# Altium project My_Robot.PrjPcb
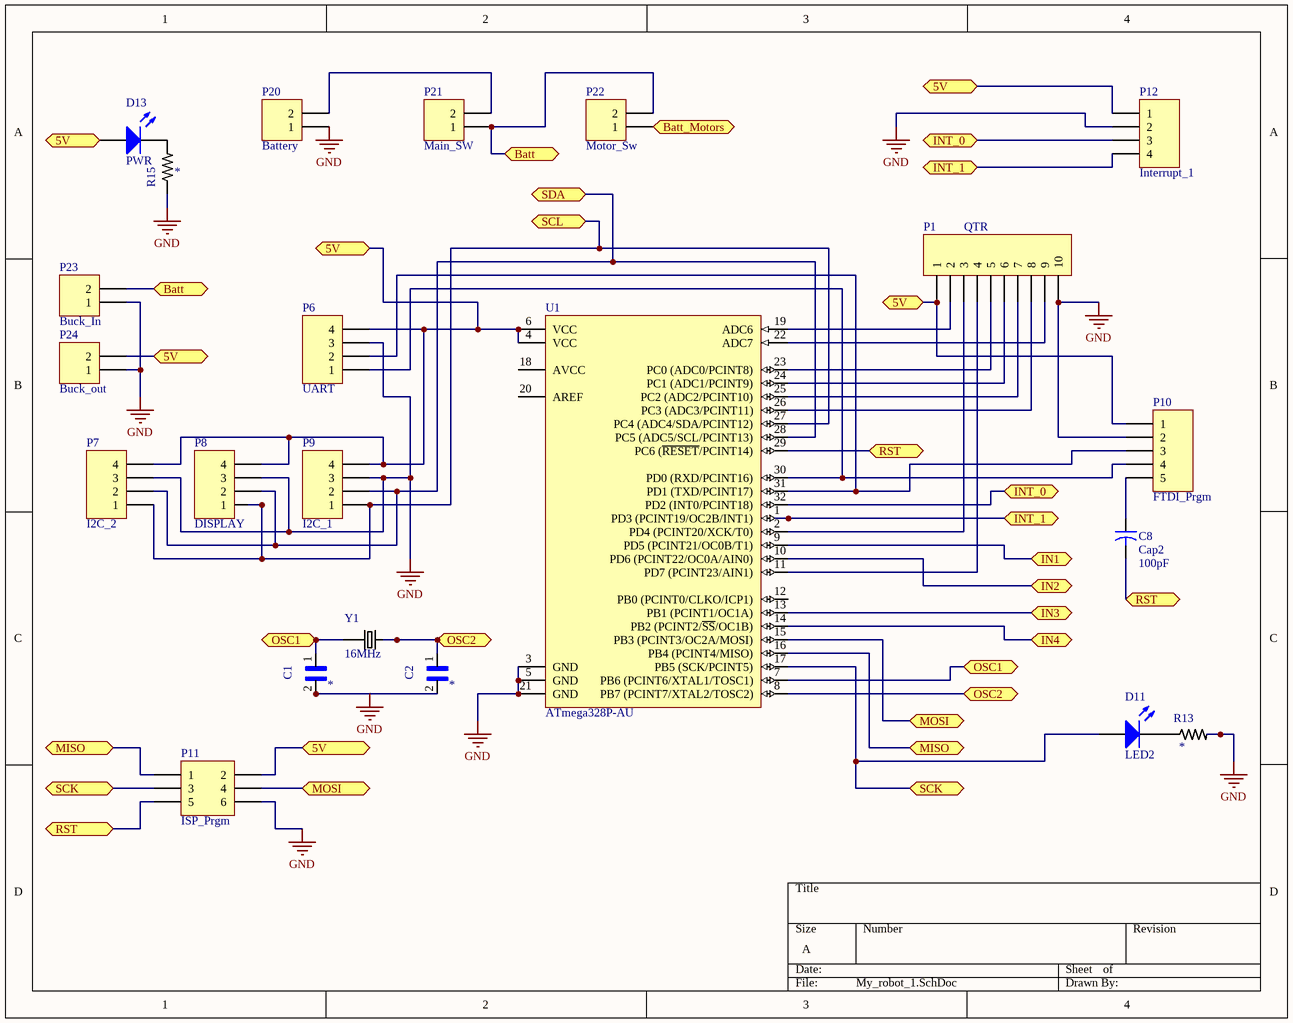
[diagram p0: My_robot_1.SchDoc]
3 sheets, 77 parts. Net scope: flat (ports and power ports of the same name join across sheets).
Board file: my_ROBOT.PcbDoc
Sheets:
  My_robot_1.SchDoc
  Motor_control.SchDoc
  MCU_2.SchDoc

## Sheet My_robot_1.SchDoc
size A

### Parts
C1  Cap_0805  [CAP_0805]  (value not drawn)
C2  Cap_0805  [CAP_0805]  (value not drawn)
C8  Cap2  value 100pF  [CAPR5-4X5]
D11  LED2  [3.2X1.6X1.1]
D13  PWR  [3.2X1.6X1.1]
P1  QTR  [HDR1X10]
P6  UART  [HDR1X4]
P7  I2C_2  [HDR1X4]
P8  DISPLAY  [HDR1X4]
P9  I2C_1  [HDR1X4]
P10  FTDI_Prgm  [HDR1X5]
P11  ISP_Prgm  [HDR2X3]
P12  Interrupt_1  [HDR1X4]
P20  Battery  [HDR1X2]
P21  Main_SW  [HDR1X2]
P22  Motor_Sw  [HDR1X2]
P23  Buck_In  [HDR1X2]
P24  Buck_out  [HDR1X2]
R13  Res_0805  [Res_0805]  (value not drawn)
R15  Res_0805  [Res_0805]  (value not drawn)
U1  ATmega328P-AU  [32A_N]
Y1  16MHz  [XTAL_THT]

### Ports
5V, Batt, Batt_Motors, IN1, IN2, IN3, IN4, INT_0, INT_1, MISO, MOSI, OSC1, OSC2, RST, SCK, SCL, SDA

### Nets
GND: C1.2 C2.2 P1.10 P6.3 P7.3 P8.3 P9.3 P10.2 P11.6 P12.2 P20.1 P23.1 P24.1 R13.2 R15.1 U1.3(GND) U1.5(GND) U1.21(GND)
NetC1_1: C1.1 U1.7(PB6_(PCINT6/XTAL1/TOSC1)) Y1.1 ; port OSC1
NetC2_1: C2.1 U1.8(PB7_(PCINT7/XTAL2/TOSC2)) Y1.2 ; port OSC2
NetC8_1: C8.1 P10.5
NetC8_2: C8.2 P11.5 U1.29(PC6_(~{RESET}/PCINT14)) ; port RST
NetD11_1: D11.1(A) P11.3 U1.17(PB5_(SCK/PCINT5)) ; port SCK
NetD11_2: D11.2(K) R13.1
NetD13_1: D13.1(A) P1.1 P6.4 P7.4 P8.4 P9.4 P10.1 P11.2 P12.1 P24.2 U1.4(VCC) U1.6(VCC) ; port 5V
NetD13_2: D13.2(K) R15.2
NetD14_1: P22.1 ; port Batt_Motors
NetP1_2: P1.2 U1.19(ADC6)
NetP1_3: P1.3 U1.2(PD4_(PCINT20/XCK/T0))
NetP1_4: P1.4 U1.11(PD7_(PCINT23/AIN1))
NetP1_5: P1.5 U1.23(PC0_(ADC0/PCINT8))
NetP1_6: P1.6 U1.24(PC1_(ADC1/PCINT9))
NetP1_7: P1.7 U1.25(PC2_(ADC2/PCINT10))
NetP1_8: P1.8 U1.26(PC3_(ADC3/PCINT11))
NetP1_9: P1.9 U1.22(ADC7)
NetP6_1: P6.1 P10.4 U1.30(PD0_(RXD/PCINT16))
NetP6_2: P6.2 P10.3 U1.31(PD1_(TXD/PCINT17))
NetP7_1: P7.1 P8.1 P9.1 U1.27(PC4_(ADC4/SDA/PCINT12)) ; port SCL
NetP7_2: P7.2 P8.2 P9.2 U1.28(PC5_(ADC5/SCL/PCINT13)) ; port SDA
NetP11_1: P11.1 U1.16(PB4_(PCINT4/MISO)) ; port MISO
NetP11_4: P11.4 U1.15(PB3_(PCINT3/OC2A/MOSI)) ; port MOSI
NetP12_3: P12.3 U1.32(PD2_(INT0/PCINT18)) ; port INT_0
NetP12_4: P12.4 U1.1(PD3_(PCINT19/OC2B/INT1)) ; port INT_1
NetP20_2: P20.2 P21.2
NetP21_1: P21.1 P22.2 P23.2 ; port Batt
NetU1_9: U1.9(PD5_(PCINT21/OC0B/T1)) ; port IN1
NetU1_10: U1.10(PD6_(PCINT22/OC0A/AIN0)) ; port IN2
NetU1_13: U1.13(PB1_(PCINT1/OC1A)) ; port IN3
NetU1_14: U1.14(PB2_(PCINT2/~{SS}/OC1B)) ; port IN4

Not connected (* = marked no-connect by the designer): U1 12(PB0_(PCINT0/CLKO/ICP1)) 18(AVCC) 20(AREF)

### Library data of the parts
C1 C2 = Cap_0805: Cap Ceramic 10uF 10V X5R 10% SMD 0805 85Â°C Embossed Plastic T/R; MF: Samsung Electro-Mechanics; MP: CL21A106KPFNNWE; Price: None; SnapEDA_Link: https://www.snapeda.com/parts/CL21A106KPFNNWE/Samsung%20Electro-Mechanics/view-part/?ref=snap; Package: 0805 Samsung; Availability: Unavailable; Value: *
C8 = Cap2: Capacitor; Published: 23-Sep-2002; PackageReference: CAPR5-4X5; Publisher: Altium Limited; PackageDescription: Capacitor; 2 Leads
D11 D13 = LED2: Typical RED, GREEN, YELLOW, AMBER GaAs LED; Published: 8-Jun-2000; LatestRevisionDate: 17-Jul-2002; LatestRevisionNote: Re-released for DXP Platform.; PackageVersion: Feb-2002; PackageReference: 3.2X1.6X1.1; Publisher: Altium Limited; PackageDescription: SM LED; 2 Flat Leads
P1 = Header 10: Header, 10-Pin; LatestRevisionDate: 17-Jul-2002; LatestRevisionNote: Re-released for DXP Platform.; Publisher: Altium Limited
P6-P9 P12 = Header 4: Header, 4-Pin; LatestRevisionDate: 17-Jul-2002; LatestRevisionNote: Re-released for DXP Platform.; Publisher: Altium Limited
P10 = Header 5: Header, 5-Pin; LatestRevisionDate: 17-Jul-2002; LatestRevisionNote: Re-released for DXP Platform.; Publisher: Altium Limited
P11 = Header 3X2: Header, 3-Pin, Dual row; LatestRevisionDate: 17-Jul-2002; LatestRevisionNote: Re-released for DXP Platform.; Publisher: Altium Limited
P20-P24 = Header 2: Header, 2-Pin; LatestRevisionDate: 17-Jul-2002; LatestRevisionNote: Re-released for DXP Platform.; Publisher: Altium Limited
R13 R15 = Res_0805: Res Thick Film 0805 392 Ohm 1% 1/3W Â±100ppm/Â°C Molded SMD SMD T/R; MP: CRGH0805F392R; MF: TE Connectivity; TE_purchase_URL: https://www.te.com/usa-en/product-5-1879509-5.html?te_bu=Cor&te_type=disp&te_campaign=seda_glo_cor-seda-global-disp-prtnr-fy19-seda-model-bom-cta_sma-317_1&elqCampaignId=32493; Availability: Unavailable; SnapEDA_Link: https://www.snapeda.com/parts/CRGH0805F392R/TE%20Connectivity%20Passive%20Product/view-part/?ref=snap; Price: None; Package: 0805 TE Connectivity; Value: *
U1 = ATmega328P-AU: 8-bit AVR Microcontroller, 32KB Flash, 1KB EEPROM, 2KB SRAM, 32-pin TQFP, Industrial Grade (-40°C to 85°C); Published: 1-Apr-2010; DatasheetVersion: revA, Jan-2010; PackageVersion: revB, Oct-2001; PackageReference: 32A; Publisher: Altium Limited; PackageDescription: 32-Lead, 7x7x1.0 mm Body, 0.8mm Lead Pitch, Thin Profile Plastic Quad Flat Package (TQFP); Supplier 1: Digi-Key; Supplier Part Number 1: ATMEGA328P-AU-ND; Supplier 2: Farnell; Supplier Part Number 2: 1715486; Supplier 3: Mouser; Supplier Part Number 3: 556-ATMEGA328P-AU; Code_JEDEC: MS-026-ABA; ComponentLink1Description: Manufacturer Link; ComponentLink1URL: http://www.atmel.com/products/avr/default.asp?; ComponentLink2Description: ATmega48A/48PA/88A/88PA/168A/168PA/328/328P Datasheet; ComponentLink2URL: http://www.atmel.com/dyn/resources/prod_documents/8271.pdf; ComponentLink3Description: ATmega48A/48PA/88A/88PA/168A/168PA/328/328P Summary; ComponentLink3URL: http://www.atmel.com/dyn/resources/prod_documents/8271S.pdf; ComponentLink4Description: Atmel.com Home; ComponentLink4URL: http://www.atmel.com
Y1 = Xtal_THT: Crystal 3.93216MHz 17pF 2-Pin HC-49/U; MF: ECS Inc.; MP: ECS-39-17-1X; Availability: Unavailable; Price: None; SnapEDA_Link: https://www.snapeda.com/parts/ECS-39-17-1X/ECS%20Inc./view-part/?ref=snap; Package: HC49/U ECS International; Value: *

## Sheet Motor_control.SchDoc
size A
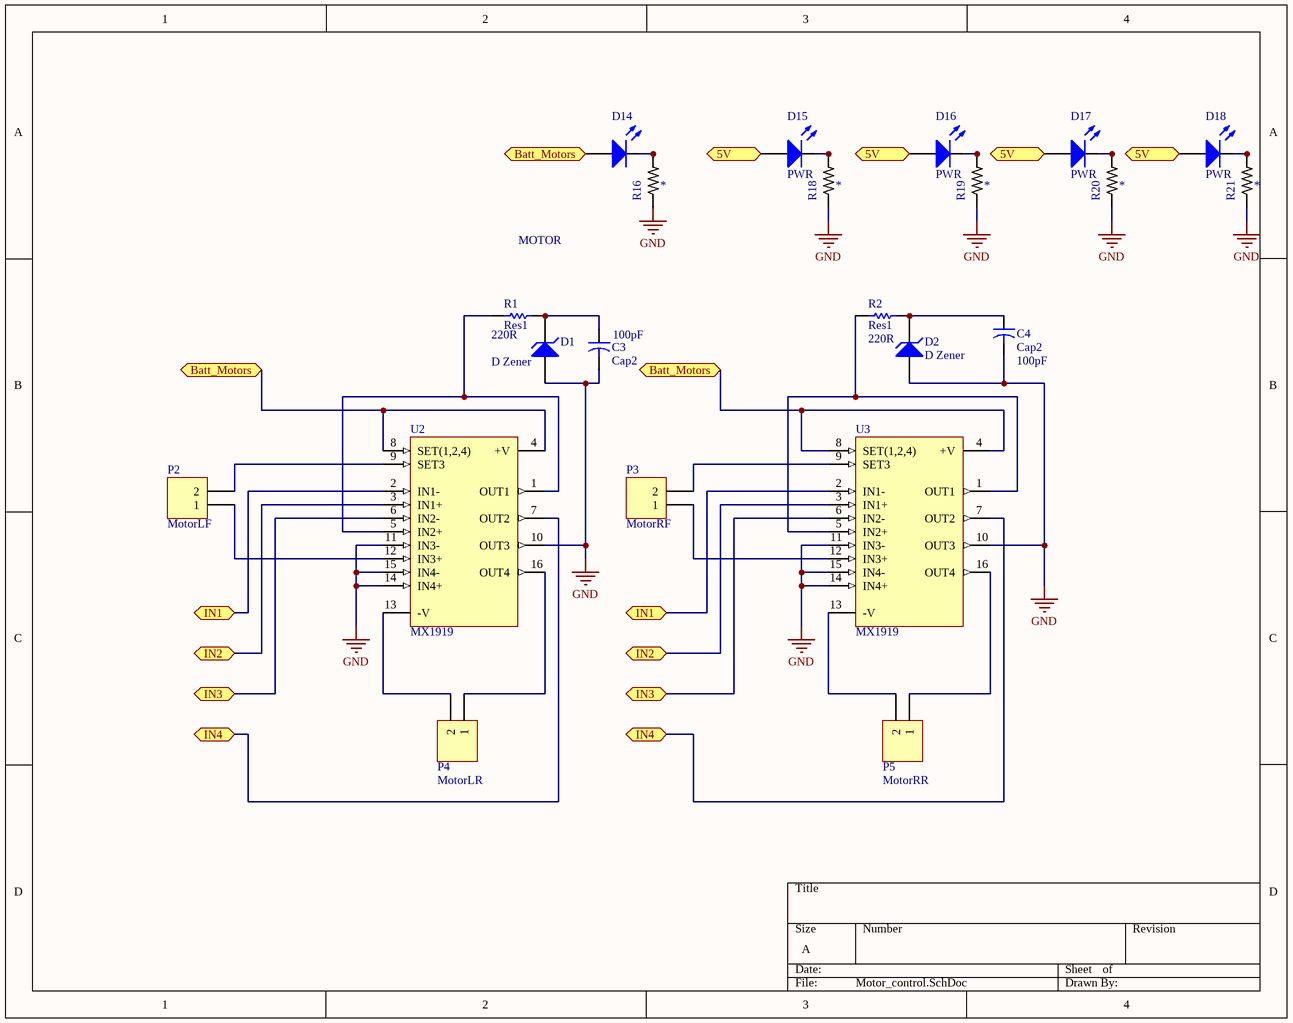
[diagram p1: Motor_control.SchDoc]

### Parts
C3  Cap2  value 100pF  [CAPR5-4X5]
C4  Cap2  value 100pF  [CAPR5-4X5]
D1  D Zener  [DIODE-0.7]
D2  D Zener  [DIODE-0.7]
D14  MOTOR  [3.2X1.6X1.1]
D15  PWR  [3.2X1.6X1.1]
D16  PWR  [3.2X1.6X1.1]
D17  PWR  [3.2X1.6X1.1]
D18  PWR  [3.2X1.6X1.1]
P2  MotorLF  [Micro_Metal_Motor]
P3  MotorRF  [Micro_Metal_Motor]
P4  MotorLR  [Micro_Metal_Motor]
P5  MotorRR  [Micro_Metal_Motor]
R1  Res1  value 220R  [AXIAL-0.3]
R2  Res1  value 220R  [AXIAL-0.3]
R16  Res_0805  [Res_0805]  (value not drawn)
R18  Res_0805  [Res_0805]  (value not drawn)
R19  Res_0805  [Res_0805]  (value not drawn)
R20  Res_0805  [Res_0805]  (value not drawn)
R21  Res_0805  [Res_0805]  (value not drawn)
U2  MX1919  [DIP16]
U3  MX1919  [DIP16]

### Ports
5V, Batt_Motors, IN1, IN2, IN3, IN4

### Nets
GND: C3.2 C4.2 D1.1(A) D2.1(A) R16.1 R18.1 R19.1 R20.1 R21.1 U2.10(OUT3) U2.11(IN3-) U2.14(IN4+) U2.15(IN4-) U3.10(OUT3) U3.11(IN3-) U3.14(IN4+) U3.15(IN4-)
NetC3_1: C3.1 D1.2(K) R1.1
NetC4_1: C4.1 D2.2(K) R2.1
NetD13_1: D15.1(A) D16.1(A) D17.1(A) D18.1(A) ; port 5V
NetD14_1: D14.1(A) U2.4(+V) U2.8(SET(1,2,4)) U3.4(+V) U3.8(SET(1,2,4)) ; port Batt_Motors
NetD14_2: D14.2(K) R16.2
NetD15_2: D15.2(K) R18.2
NetD16_2: D16.2(K) R19.2
NetD17_2: D17.2(K) R20.2
NetD18_2: D18.2(K) R21.2
NetP2_1: P2.1 U2.12(IN3+)
NetP2_2: P2.2 U2.9(SET3)
NetP3_1: P3.1 U3.12(IN3+)
NetP3_2: P3.2 U3.9(SET3)
NetP4_1: P4.1 U2.16(OUT4)
NetP4_2: P4.2 U2.13(-V)
NetP5_1: P5.1 U3.16(OUT4)
NetP5_2: P5.2 U3.13(-V)
NetR1_2: R1.2 U2.1(OUT1) U2.5(IN2+)
NetR2_2: R2.2 U3.1(OUT1) U3.5(IN2+)
NetU1_9: U2.2(IN1-) U3.2(IN1-) ; port IN1
NetU1_10: U2.3(IN1+) U3.3(IN1+) ; port IN2
NetU1_13: U2.6(IN2-) U3.6(IN2-) ; port IN3
NetU1_14: U2.7(OUT2) U3.7(OUT2) ; port IN4

### Library data of the parts
C3 C4 = Cap2: Capacitor; Published: 23-Sep-2002; PackageReference: CAPR5-4X5; Publisher: Altium Limited; PackageDescription: Capacitor; 2 Leads
D1 D2 = D Zener: Zener Diode; Published: 8-Jun-2000; LatestRevisionDate: 17-Jul-2002; LatestRevisionNote: Re-released for DXP Platform.; PackageReference: DIODE-0.7; Publisher: Altium Limited; PackageDescription: Diode, Thru-Hole; 2 Leads; 0.7 in Pin Spacing
D14-D18 = LED2: as D11 on sheet My_robot_1; Published: 8-Jun-2000; LatestRevisionDate: 17-Jul-2002; LatestRevisionNote: Re-released for DXP Platform.; PackageVersion: Feb-2002; PackageReference: 3.2X1.6X1.1; Publisher: Altium Limited; PackageDescription: SM LED; 2 Flat Leads
P2-P5 = Header 2: Header, 2-Pin; LatestRevisionDate: 17-Jul-2002; LatestRevisionNote: Re-released for DXP Platform.; Publisher: Altium Limited
R1 R2 = Res1: Resistor; Published: 8-Jun-2000; LatestRevisionDate: 17-Jul-2002; LatestRevisionNote: Re-released for DXP Platform.; PackageReference: AXIAL-0.3; Publisher: Altium Limited; PackageDescription: Axial Device, Thru-Hole; 2 Leads; 0.3 in Pin Spacing
R16 R18-R21 = Res_0805: as R13 on sheet My_robot_1; TE_purchase_URL: https://www.te.com/usa-en/product-5-1879509-5.html?te_bu=Cor&te_type=disp&te_campaign=seda_glo_cor-seda-global-disp-prtnr-fy19-seda-model-bom-cta_sma-317_1&elqCampaignId=32493; Availability: Unavailable; SnapEDA_Link: https://www.snapeda.com/parts/CRGH0805F392R/TE%20Connectivity%20Passive%20Product/view-part/?ref=snap; Price: None; Package: 0805 TE Connectivity; Value: *
U2 U3 = LM246N: Programmable Quad Bipolar Operational Amplifier; Published: 24-Aug-2001; LatestRevisionDate: 06-Jun-2005; LatestRevisionNote: Stylized 3D Model Added.; DatasheetVersion: Nov-1997; PackageVersion: Apr-1996; PackageReference: DIP16; Publisher: Altium Limited; PackageDescription: DIP; 16 Leads; Row Spacing 7.62 mm; Pitch 2.54 mm; ComponentLink1Description: Manufacturer Link; ComponentLink1URL: http://www.st.com/; ComponentLink2Description: Datasheet; ComponentLink2URL: http://www.st.com/stonline/products/literature/ds/2160/lm346.pdf

## Sheet MCU_2.SchDoc
size A
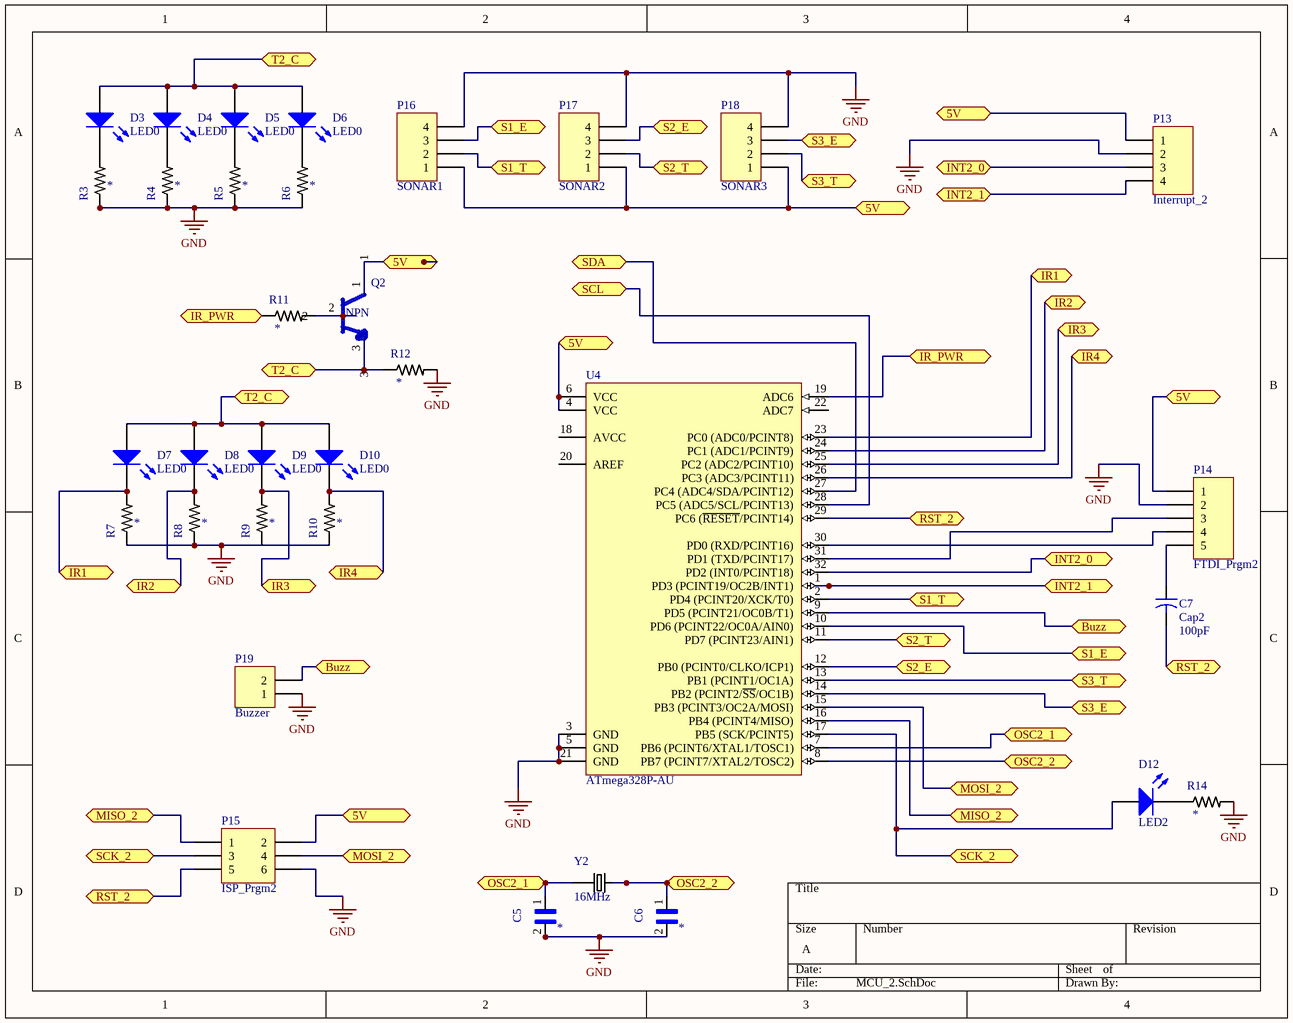
[diagram p2: MCU_2.SchDoc]

### Parts
C5  Cap_0805  [CAP_0805]  (value not drawn)
C6  Cap_0805  [CAP_0805]  (value not drawn)
C7  Cap2  value 100pF  [CAPR5-4X5]
D3  LED0  [LED-1]
D4  LED0  [LED-1]
D5  LED0  [LED-1]
D6  LED0  [LED-1]
D7  LED0  [LED-1]
D8  LED0  [LED-1]
D9  LED0  [LED-1]
D10  LED0  [LED-1]
D12  LED2  [3.2X1.6X1.1]
P13  Interrupt_2  [HDR1X4]
P14  FTDI_Prgm2  [HDR1X5]
P15  ISP_Prgm2  [HDR2X3]
P16  SONAR1  [HDR1X4]
P17  SONAR2  [HDR1X4]
P18  SONAR3  [HDR1X4]
P19  Buzzer  [HDR1X2]
Q2  NPN  [NPN-d400]
R3  Res_0805  [Res_0805]  (value not drawn)
R4  Res_0805  [Res_0805]  (value not drawn)
R5  Res_0805  [Res_0805]  (value not drawn)
R6  Res_0805  [Res_0805]  (value not drawn)
R7  Res_0805  [Res_0805]  (value not drawn)
R8  Res_0805  [Res_0805]  (value not drawn)
R9  Res_0805  [Res_0805]  (value not drawn)
R10  Res_0805  [Res_0805]  (value not drawn)
R11  Res_0805  [Res_0805]  (value not drawn)
R12  Res_0805  [Res_0805]  (value not drawn)
R14  Res_0805  [Res_0805]  (value not drawn)
U4  ATmega328P-AU  [32A_N]
Y2  16MHz  [XTAL_THT]

### Ports
5V, Buzz, INT2_0, INT2_1, IR1, IR2, IR3, IR4, IR_PWR, MISO_2, MOSI_2, OSC2_1, OSC2_2, RST_2, S1_E, S1_T, S2_E, S2_T, S3_E, S3_T, SCK_2, SCL, SDA, T2_C

### Nets
GND: C5.2 C6.2 P13.2 P14.2 P15.6 P16.4 P17.4 P18.4 P19.1 R3.1 R4.1 R5.1 R6.1 R7.1 R8.1 R9.1 R10.1 R12.2 R14.2 U4.3(GND) U4.5(GND) U4.21(GND)
NetC5_1: C5.1 U4.7(PB6_(PCINT6/XTAL1/TOSC1)) Y2.1 ; port OSC2_1
NetC6_1: C6.1 U4.8(PB7_(PCINT7/XTAL2/TOSC2)) Y2.2 ; port OSC2_2
NetC7_1: C7.1 P14.5
NetC7_2: C7.2 P15.5 U4.29(PC6_(~{RESET}/PCINT14)) ; port RST_2
NetD3_1: D3.1(A) D4.1(A) D5.1(A) D6.1(A) D7.1(A) D8.1(A) D9.1(A) D10.1(A) Q2.3 R12.1 ; port T2_C
NetD3_2: D3.2(K) R3.2
NetD4_2: D4.2(K) R4.2
NetD5_2: D5.2(K) R5.2
NetD6_2: D6.2(K) R6.2
NetD7_2: D7.2(K) R7.2 U4.23(PC0_(ADC0/PCINT8)) ; port IR1
NetD8_2: D8.2(K) R8.2 U4.24(PC1_(ADC1/PCINT9)) ; port IR2
NetD9_2: D9.2(K) R9.2 U4.25(PC2_(ADC2/PCINT10)) ; port IR3
NetD10_2: D10.2(K) R10.2 U4.26(PC3_(ADC3/PCINT11)) ; port IR4
NetD12_1: D12.1(A) P15.3 U4.17(PB5_(SCK/PCINT5)) ; port SCK_2
NetD12_2: D12.2(K) R14.1
NetD13_1: P13.1 P14.1 P15.2 P16.1 P17.1 P18.1 Q2.1 U4.4(VCC) U4.6(VCC) ; port 5V
NetP7_1: U4.28(PC5_(ADC5/SCL/PCINT13)) ; port SCL
NetP7_2: U4.27(PC4_(ADC4/SDA/PCINT12)) ; port SDA
NetP13_3: P13.3 U4.32(PD2_(INT0/PCINT18)) ; port INT2_0
NetP13_4: P13.4 U4.1(PD3_(PCINT19/OC2B/INT1)) ; port INT2_1
NetP14_3: P14.3 U4.31(PD1_(TXD/PCINT17))
NetP14_4: P14.4 U4.30(PD0_(RXD/PCINT16))
NetP15_1: P15.1 U4.16(PB4_(PCINT4/MISO)) ; port MISO_2
NetP15_4: P15.4 U4.15(PB3_(PCINT3/OC2A/MOSI)) ; port MOSI_2
NetP16_2: P16.2 U4.2(PD4_(PCINT20/XCK/T0)) ; port S1_T
NetP16_3: P16.3 U4.10(PD6_(PCINT22/OC0A/AIN0)) ; port S1_E
NetP17_2: P17.2 U4.11(PD7_(PCINT23/AIN1)) ; port S2_T
NetP17_3: P17.3 U4.12(PB0_(PCINT0/CLKO/ICP1)) ; port S2_E
NetP18_2: P18.2 U4.13(PB1_(PCINT1/OC1A)) ; port S3_T
NetP18_3: P18.3 U4.14(PB2_(PCINT2/~{SS}/OC1B)) ; port S3_E
NetP19_2: P19.2 U4.9(PD5_(PCINT21/OC0B/T1)) ; port Buzz
NetQ2_2: Q2.2 R11.2
NetR11_1: R11.1 U4.19(ADC6) ; port IR_PWR

Not connected (* = marked no-connect by the designer): U4 18(AVCC) 20(AREF) 22(ADC7)

### Library data of the parts
C5 C6 = Cap_0805: as C1 on sheet My_robot_1; Price: None; SnapEDA_Link: https://www.snapeda.com/parts/CL21A106KPFNNWE/Samsung%20Electro-Mechanics/view-part/?ref=snap; Package: 0805 Samsung; Availability: Unavailable; Value: *
C7 = Cap2: Capacitor; Published: 23-Sep-2002; PackageReference: CAPR5-4X5; Publisher: Altium Limited; PackageDescription: Capacitor; 2 Leads
D3-D10 = LED0: Typical INFRARED GaAs LED; Published: 8-Jun-2000; LatestRevisionDate: 08-Jul-2005; LatestRevisionNote: Mech Layer 1 removed.; PackageReference: LED-0; Publisher: Altium Limited; PackageDescription: LED; 2 Leads
D12 = LED2: as D11 on sheet My_robot_1; Published: 8-Jun-2000; LatestRevisionDate: 17-Jul-2002; LatestRevisionNote: Re-released for DXP Platform.; PackageVersion: Feb-2002; PackageReference: 3.2X1.6X1.1; Publisher: Altium Limited; PackageDescription: SM LED; 2 Flat Leads
P13 P16-P18 = Header 4: Header, 4-Pin; LatestRevisionDate: 17-Jul-2002; LatestRevisionNote: Re-released for DXP Platform.; Publisher: Altium Limited
P14 = Header 5: Header, 5-Pin; LatestRevisionDate: 17-Jul-2002; LatestRevisionNote: Re-released for DXP Platform.; Publisher: Altium Limited
P15 = Header 3X2: Header, 3-Pin, Dual row; LatestRevisionDate: 17-Jul-2002; LatestRevisionNote: Re-released for DXP Platform.; Publisher: Altium Limited
P19 = Header 2: Header, 2-Pin; LatestRevisionDate: 17-Jul-2002; LatestRevisionNote: Re-released for DXP Platform.; Publisher: Altium Limited
Q2 = Component_1: NPN- d400
R3-R12 R14 = Res_0805: as R13 on sheet My_robot_1; TE_purchase_URL: https://www.te.com/usa-en/product-5-1879509-5.html?te_bu=Cor&te_type=disp&te_campaign=seda_glo_cor-seda-global-disp-prtnr-fy19-seda-model-bom-cta_sma-317_1&elqCampaignId=32493; Availability: Unavailable; SnapEDA_Link: https://www.snapeda.com/parts/CRGH0805F392R/TE%20Connectivity%20Passive%20Product/view-part/?ref=snap; Price: None; Package: 0805 TE Connectivity; Value: *
U4 = ATmega328P-AU: as U1 on sheet My_robot_1; Published: 1-Apr-2010; DatasheetVersion: revA, Jan-2010; PackageVersion: revB, Oct-2001; PackageReference: 32A; Publisher: Altium Limited; PackageDescription: 32-Lead, 7x7x1.0 mm Body, 0.8mm Lead Pitch, Thin Profile Plastic Quad Flat Package (TQFP); Supplier 1: Digi-Key; Supplier Part Number 1: ATMEGA328P-AU-ND; Supplier 2: Farnell; Supplier Part Number 2: 1715486; Supplier 3: Mouser; Supplier Part Number 3: 556-ATMEGA328P-AU; Code_JEDEC: MS-026-ABA; ComponentLink1Description: Manufacturer Link; ComponentLink1URL: http://www.atmel.com/products/avr/default.asp?; ComponentLink2Description: ATmega48A/48PA/88A/88PA/168A/168PA/328/328P Datasheet; ComponentLink2URL: http://www.atmel.com/dyn/resources/prod_documents/8271.pdf; ComponentLink3Description: ATmega48A/48PA/88A/88PA/168A/168PA/328/328P Summary; ComponentLink3URL: http://www.atmel.com/dyn/resources/prod_documents/8271S.pdf; ComponentLink4Description: Atmel.com Home; ComponentLink4URL: http://www.atmel.com
Y2 = Xtal_THT: as Y1 on sheet My_robot_1; Availability: Unavailable; Price: None; SnapEDA_Link: https://www.snapeda.com/parts/ECS-39-17-1X/ECS%20Inc./view-part/?ref=snap; Package: HC49/U ECS International; Value: *

## Nets that join several sheets
GND: My_robot_1 (18 pins), Motor_control (17 pins), MCU_2 (22 pins)
NetD13_1: My_robot_1 (12 pins), Motor_control (D15.1 D16.1 D17.1 D18.1), MCU_2 (9 pins)
NetD14_1: My_robot_1 (P22.1), Motor_control (5 pins)
NetP7_1: My_robot_1 (P7.1 P8.1 P9.1 U1.27), MCU_2 (U4.28)
NetP7_2: My_robot_1 (P7.2 P8.2 P9.2 U1.28), MCU_2 (U4.27)
NetU1_9: My_robot_1 (U1.9), Motor_control (U2.2 U3.2)
NetU1_10: My_robot_1 (U1.10), Motor_control (U2.3 U3.3)
NetU1_13: My_robot_1 (U1.13), Motor_control (U2.6 U3.6)
NetU1_14: My_robot_1 (U1.14), Motor_control (U2.7 U3.7)